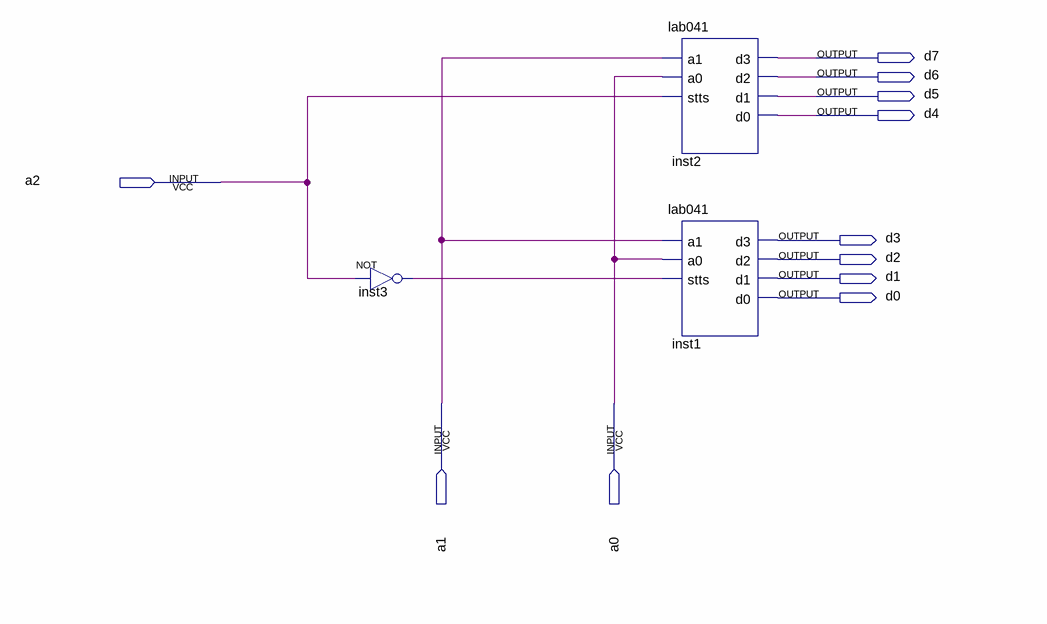
[diagram p0: schematic sheet]
// Quartus schematic lab0412.bdf as structural Verilog: 3 symbols, 11 pins
module lab0412 (
  input  a2,
  input  a1,
  input  a0,
  output d7,
  output d6,
  output d5,
  output d4,
  output d3,
  output d2,
  output d1,
  output d0
);

  wire inst3_out;

  not inst3 (inst3_out, a2);
  lab041 inst2 (.a1(a1), .a0(a0), .stts(a2), .d3(d7), .d2(d6), .d1(d5), .d0(d4));
  lab041 inst1 (.a1(a1), .a0(a0), .stts(inst3_out), .d3(d3), .d2(d2), .d1(d1), .d0(d0));
endmodule
